# Altium schematic sheet TC387.SchDoc
size A3; SheetNumber: 3; SheetTotal: 6
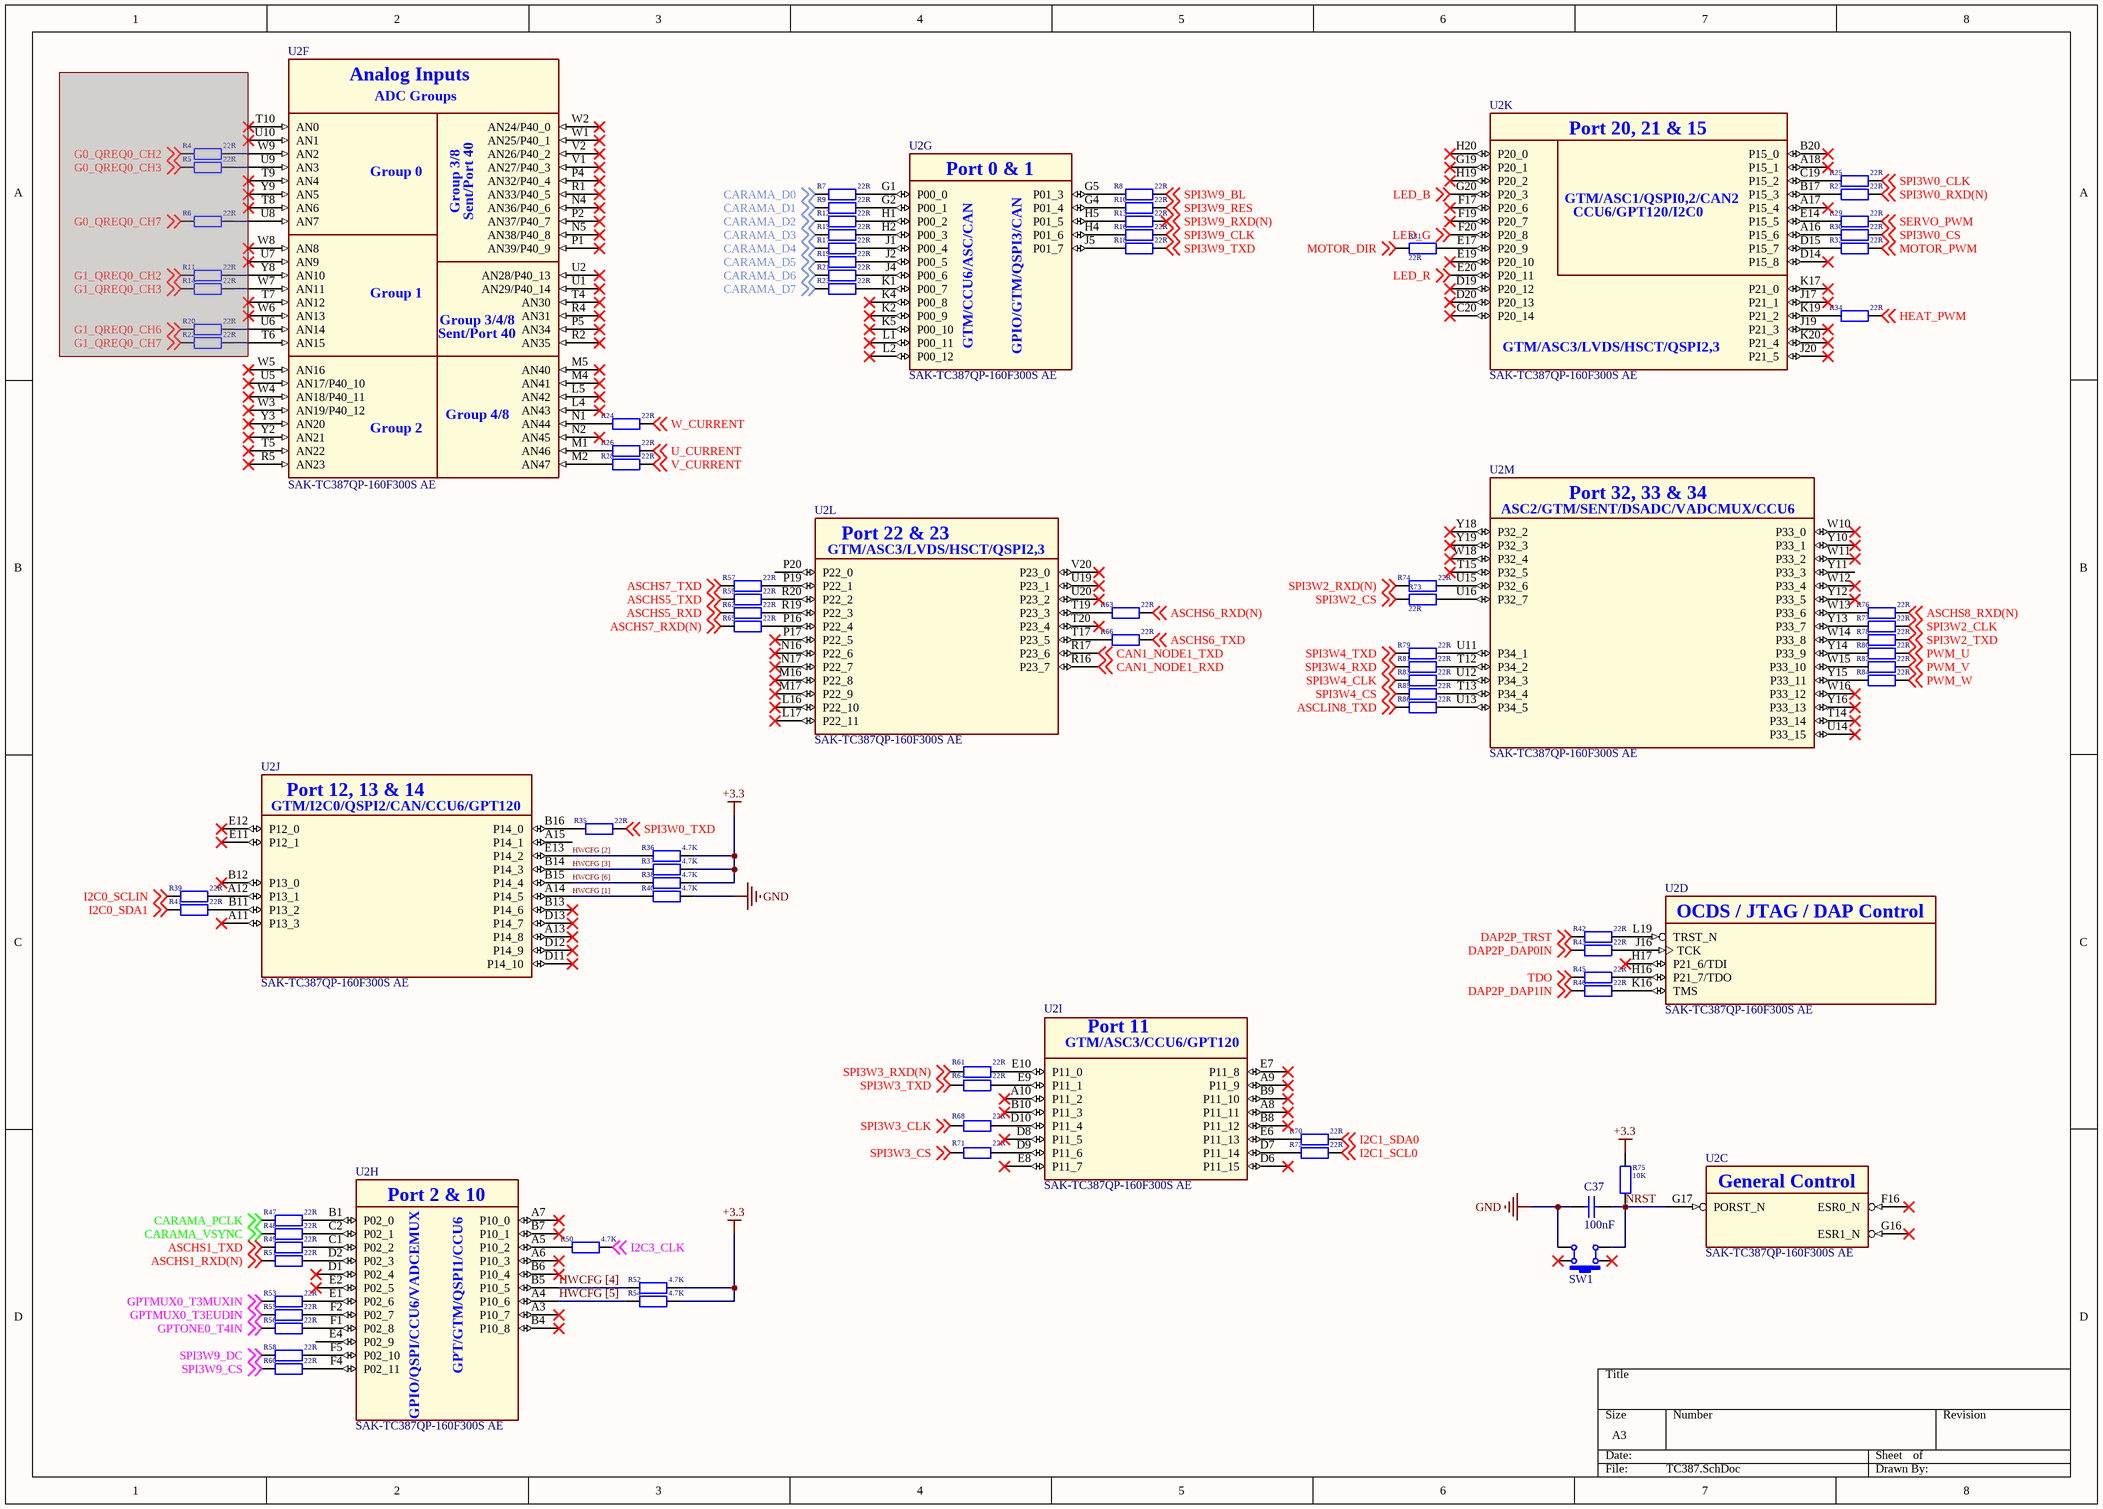
[diagram p0: TC387.SchDoc]

## Parts
C37  100nF  [C0402_L]
R4  22R  [R0402_L]  (masked out: inside a compile mask, not in the netlist)
R5  22R  [R0402_L]  (masked out: inside a compile mask, not in the netlist)
R6  22R  [R0402_L]  (masked out: inside a compile mask, not in the netlist)
R7  22R  [R0402_L]
R8  22R  [R0402_L]
R9  22R  [R0402_L]
R10  22R  [R0402_L]
R11  22R  [R0402_L]  (masked out: inside a compile mask, not in the netlist)
R12  22R  [R0402_L]
R13  22R  [R0402_L]
R14  22R  [R0402_L]  (masked out: inside a compile mask, not in the netlist)
R15  22R  [R0402_L]
R16  22R  [R0402_L]
R17  22R  [R0402_L]
R18  22R  [R0402_L]
R19  22R  [R0402_L]
R20  22R  [R0402_L]  (masked out: inside a compile mask, not in the netlist)
R21  22R  [R0402_L]
R22  22R  [R0402_L]  (masked out: inside a compile mask, not in the netlist)
R23  22R  [R0402_L]
R24  22R  [R0402_L]
R25  22R  [R0402_L]
R26  22R  [R0402_L]
R27  22R  [R0402_L]
R28  22R  [R0402_L]
R29  22R  [R0402_L]
R30  22R  [R0402_L]
R31  22R  [R0402_L]
R32  22R  [R0402_L]
R34  22R  [R0402_L]
R35  22R  [R0402_L]
R36  4.7K  [R0402_L]
R37  4.7K  [R0402_L]
R38  4.7K  [R0402_L]
R39  22R  [R0402_L]
R40  4.7K  [R0402_L]
R41  22R  [R0402_L]
R42  22R  [R0402_L]
R43  22R  [R0402_L]
R45  22R  [R0402_L]
R46  22R  [R0402_L]
R47  22R  [R0402_L]
R48  22R  [R0402_L]
R49  22R  [R0402_L]
R50  4.7K  [R0402_L]
R51  22R  [R0402_L]
R52  4.7K  [R0402_L]
R53  22R  [R0402_L]
R54  4.7K  [R0402_L]
R55  22R  [R0402_L]
R56  22R  [R0402_L]
R57  22R  [R0402_L]
R58  22R  [R0402_L]
R59  22R  [R0402_L]
R60  22R  [R0402_L]
R61  22R  [R0402_L]
R62  22R  [R0402_L]
R63  22R  [R0402_L]
R64  22R  [R0402_L]
R65  22R  [R0402_L]
R66  22R  [R0402_L]
R68  22R  [R0402_L]
R70  22R  [R0402_L]
R71  22R  [R0402_L]
R72  22R  [R0402_L]
R73  22R  [R0402_L]
R74  22R  [R0402_L]
R75  10K  [R0402_L]
R76  22R  [R0402_L]
R77  22R  [R0402_L]
R78  22R  [R0402_L]
R79  22R  [R0402_L]
R80  22R  [R0402_L]
R81  22R  [R0402_L]
R82  22R  [R0402_L]
R83  22R  [R0402_L]
R84  22R  [R0402_L]
R85  22R  [R0402_L]
R86  22R  [R0402_L]
SW1  TD-1187SA-250  [SW-SMD-3.5*3.0_4P]  (value not drawn)
U2  SAK-TC387QP-160F300S AE  [BGA292C80P20X20_1700X1700X170]  (parts C,D,F,G,H,I,J,K,L,M of 13)

## Nets
+3.3: R36.2 R37.2 R38.2 R52.2 R54.2 R75.1
GND: C37.2 R40.2 SW1.3
ASCHS1_RXD(N): R51.1 ; off-sheet ASCHS1_RXD(N)
ASCHS1_TXD: R49.1 ; off-sheet ASCHS1_TXD
ASCHS5_RXD: R62.1 ; off-sheet ASCHS5_RXD
ASCHS5_TXD: R59.1 ; off-sheet ASCHS5_TXD
ASCHS6_RXD(N): R63.2 ; off-sheet ASCHS6_RXD(N)
ASCHS6_TXD: R66.2 ; off-sheet ASCHS6_TXD
ASCHS7_RXD(N): R65.1 ; off-sheet ASCHS7_RXD(N)
ASCHS7_TXD: R57.1 ; off-sheet ASCHS7_TXD
ASCHS8_RXD(N): R76.2 ; off-sheet ASCHS8_RXD(N)
ASCLIN8_TXD: R86.1 ; off-sheet ASCLIN8_TXD
CAN1_NODE1_RXD: U2.R16(P23_7) ; off-sheet CAN1_NODE1_RXD
CAN1_NODE1_TXD: U2.R17(P23_6) ; off-sheet CAN1_NODE1_TXD
CARAMA_D0: R7.1 ; off-sheet CARAMA_D0
CARAMA_D1: R9.1 ; off-sheet CARAMA_D1
CARAMA_D2: R12.1 ; off-sheet CARAMA_D2
CARAMA_D3: R15.1 ; off-sheet CARAMA_D3
CARAMA_D4: R17.1 ; off-sheet CARAMA_D4
CARAMA_D5: R19.1 ; off-sheet CARAMA_D5
CARAMA_D6: R21.1 ; off-sheet CARAMA_D6
CARAMA_D7: R23.1 ; off-sheet CARAMA_D7
CARAMA_PCLK: R47.1 ; off-sheet CARAMA_PCLK
CARAMA_VSYNC: R48.1 ; off-sheet CARAMA_VSYNC
DAP2P_DAP0IN: R43.1 ; off-sheet DAP2P_DAP0IN
DAP2P_DAP1IN: R46.1 ; off-sheet DAP2P_DAP1IN
DAP2P_TRST: R42.1 ; off-sheet DAP2P_TRST
GPTMUX0_T3EUDIN: R55.1 ; off-sheet GPTMUX0_T3EUDIN
GPTMUX0_T3MUXIN: R53.1 ; off-sheet GPTMUX0_T3MUXIN
GPTONE0_T4IN: R56.1 ; off-sheet GPTONE0_T4IN
HEAT_PWM: R34.2 ; off-sheet HEAT_PWM
HWCFG [1]: R40.1 U2.A14(P14_5)
HWCFG [2]: R36.1 U2.E13(P14_2)
HWCFG [3]: R37.1 U2.B14(P14_3)
HWCFG [4]: R52.1 U2.B5(P10_5)
HWCFG [5]: R54.1 U2.A4(P10_6)
HWCFG [6]: R38.1 U2.B15(P14_4)
I2C0_SCLIN: R39.1 ; off-sheet I2C0_SCLIN
I2C0_SDA1: R41.1 ; off-sheet I2C0_SDA1
I2C1_SCL0: R72.2 ; off-sheet I2C1_SCL0
I2C1_SDA0: R70.2 ; off-sheet I2C1_SDA0
I2C3_CLK: R50.2 ; off-sheet I2C3_CLK
LED_B: U2.G20(P20_3) ; off-sheet LED_B
LED_G: U2.F20(P20_8) ; off-sheet LED_G
LED_R: U2.E20(P20_11) ; off-sheet LED_R
MOTOR_DIR: R31.2 ; off-sheet MOTOR_DIR
MOTOR_PWM: R32.2 ; off-sheet MOTOR_PWM
NRST: C37.1 R75.2 SW1.4 U2.G17(PORST_N)
PWM_U: R80.2 ; off-sheet PWM_U
PWM_V: R82.2 ; off-sheet PWM_V
PWM_W: R84.2 ; off-sheet PWM_W
SERVO_PWM: R29.2 ; off-sheet SERVO_PWM
SPI3W0_CLK: R25.2 ; off-sheet SPI3W0_CLK
SPI3W0_CS: R30.2 ; off-sheet SPI3W0_CS
SPI3W0_RXD(N): R27.2 ; off-sheet SPI3W0_RXD(N)
SPI3W0_TXD: R35.2 ; off-sheet SPI3W0_TXD
SPI3W2_CLK: R77.2 ; off-sheet SPI3W2_CLK
SPI3W2_CS: R73.1 ; off-sheet SPI3W2_CS
SPI3W2_RXD(N): R74.1 ; off-sheet SPI3W2_RXD(N)
SPI3W2_TXD: R78.2 ; off-sheet SPI3W2_TXD
SPI3W3_CLK: R68.2 ; off-sheet SPI3W3_CLK
SPI3W3_CS: R71.2 ; off-sheet SPI3W3_CS
SPI3W3_RXD(N): R61.2 ; off-sheet SPI3W3_RXD(N)
SPI3W3_TXD: R64.2 ; off-sheet SPI3W3_TXD
SPI3W4_CLK: R83.1 ; off-sheet SPI3W4_CLK
SPI3W4_CS: R85.1 ; off-sheet SPI3W4_CS
SPI3W4_RXD: R81.1 ; off-sheet SPI3W4_RXD
SPI3W4_TXD: R79.1 ; off-sheet SPI3W4_TXD
SPI3W9_BL: R8.2 ; off-sheet SPI3W9_BL
SPI3W9_CLK: R16.2 ; off-sheet SPI3W9_CLK
SPI3W9_CS: R60.1 ; off-sheet SPI3W9_CS
SPI3W9_DC: R58.1 ; off-sheet SPI3W9_DC
SPI3W9_RES: R10.2 ; off-sheet SPI3W9_RES
SPI3W9_RXD(N): R13.2 ; off-sheet SPI3W9_RXD(N)
SPI3W9_TXD: R18.2 ; off-sheet SPI3W9_TXD
TDO: R45.1 ; off-sheet TDO
U_CURRENT: R26.2 ; off-sheet U_CURRENT
V_CURRENT: R28.2 ; off-sheet V_CURRENT
W_CURRENT: R24.2 ; off-sheet W_CURRENT
NetR7_2: R7.2 U2.G1(P00_0)
NetR8_1: R8.1 U2.G5(P01_3)
NetR9_2: R9.2 U2.G2(P00_1)
NetR10_1: R10.1 U2.G4(P01_4)
NetR12_2: R12.2 U2.H1(P00_2)
NetR13_1: R13.1 U2.H5(P01_5)
NetR15_2: R15.2 U2.H2(P00_3)
NetR16_1: R16.1 U2.H4(P01_6)
NetR17_2: R17.2 U2.J1(P00_4)
NetR18_1: R18.1 U2.J5(P01_7)
NetR19_2: R19.2 U2.J2(P00_5)
NetR21_2: R21.2 U2.J4(P00_6)
NetR23_2: R23.2 U2.K1(P00_7)
NetR24_1: R24.1 U2.N1(AN44)
NetR25_1: R25.1 U2.C19(P15_2)
NetR26_1: R26.1 U2.M1(AN46)
NetR27_1: R27.1 U2.B17(P15_3)
NetR28_1: R28.1 U2.M2(AN47)
NetR29_1: R29.1 U2.E14(P15_5)
NetR30_1: R30.1 U2.A16(P15_6)
NetR31_1: R31.1 U2.E17(P20_9)
NetR32_1: R32.1 U2.D15(P15_7)
NetR34_1: R34.1 U2.K19(P21_2)
NetR35_1: R35.1 U2.B16(P14_0)
NetR39_2: R39.2 U2.A12(P13_1)
NetR41_2: R41.2 U2.B11(P13_2)
NetR42_2: R42.2 U2.L19(TRST_N)
NetR43_2: R43.2 U2.J16(TCK)
NetR45_2: R45.2 U2.H16(P21_7/TDO)
NetR46_2: R46.2 U2.K16(TMS)
NetR47_2: R47.2 U2.B1(P02_0)
NetR48_2: R48.2 U2.C2(P02_1)
NetR49_2: R49.2 U2.C1(P02_2)
NetR50_1: R50.1 U2.A5(P10_2)
NetR51_2: R51.2 U2.D2(P02_3)
NetR53_2: R53.2 U2.E1(P02_6)
NetR55_2: R55.2 U2.F2(P02_7)
NetR56_2: R56.2 U2.F1(P02_8)
NetR57_2: R57.2 U2.P19(P22_1)
NetR58_2: R58.2 U2.F5(P02_10)
NetR59_2: R59.2 U2.R20(P22_2)
NetR60_2: R60.2 U2.F4(P02_11)
NetR61_1: R61.1 U2.E10(P11_0)
NetR62_2: R62.2 U2.R19(P22_3)
NetR63_1: R63.1 U2.T19(P23_3)
NetR64_1: R64.1 U2.E9(P11_1)
NetR65_2: R65.2 U2.P16(P22_4)
NetR66_1: R66.1 U2.T17(P23_5)
NetR68_1: R68.1 U2.D10(P11_4)
NetR70_1: R70.1 U2.E6(P11_13)
NetR71_1: R71.1 U2.D9(P11_6)
NetR72_1: R72.1 U2.D7(P11_14)
NetR73_2: R73.2 U2.U16(P32_7)
NetR74_2: R74.2 U2.U15(P32_6)
NetR76_1: R76.1 U2.W13(P33_6)
NetR77_1: R77.1 U2.Y13(P33_7)
NetR78_1: R78.1 U2.W14(P33_8)
NetR79_2: R79.2 U2.U11(P34_1)
NetR80_1: R80.1 U2.Y14(P33_9)
NetR81_2: R81.2 U2.T12(P34_2)
NetR82_1: R82.1 U2.W15(P33_10)
NetR83_2: R83.2 U2.U12(P34_3)
NetR84_1: R84.1 U2.Y15(P33_11)
NetR85_2: R85.2 U2.T13(P34_4)
NetR86_2: R86.2 U2.U13(P34_5)

Not connected (* = marked no-connect by the designer): SW1 1* 2*; U2 A3(P10_7)* A6(P10_3)* A7(P10_0)* A8(P11_11)* A9(P11_9)* A10(P11_2)* A11(P13_3)* A13(P14_8)* A15(P14_1) A17(P15_4)* A18(P15_1)* B4(P10_8)* B6(P10_4)* B7(P10_1)* B8(P11_12)* B9(P11_10)* B10(P11_3)* B12(P13_0)* B13(P14_6)* B20(P15_0)* C20(P20_14)* D1(P02_4)* D6(P11_15)* D8(P11_5)* D11(P14_10)* D12(P14_9)* D13(P14_7)* D14(P15_8)* D19(P20_12)* D20(P20_13)* E2(P02_5)* E4(P02_9) E7(P11_8)* E8(P11_7)* E11(P12_1)* E12(P12_0)* E19(P20_10)* F16(ESR0_N)* F17(P20_6)* F19(P20_7)* G16(ESR1_N)* G19(P20_1)* H17(P21_6/TDI)* H19(P20_2)* H20(P20_0)* J17(P21_1)* J19(P21_3)* J20(P21_5)* K2(P00_9)* K4(P00_8)* K5(P00_10)* K17(P21_0)* K20(P21_4)* L1(P00_11)* L2(P00_12)* L4(AN43)* L5(AN42)* L16(P22_10)* L17(P22_11)* M4(AN41)* M5(AN40)* M16(P22_8)* M17(P22_9)* N2(AN45)* N4(AN36/P40_6)* N5(AN38/P40_8)* N16(P22_6)* N17(P22_7)* P1(AN39/P40_9)* P2(AN37/P40_7)* P4(AN32/P40_4)* P5(AN34)* P17(P22_5)* P20(P22_0) R1(AN33/P40_5)* R2(AN35)* R4(AN31)* R5(AN23)* T4(AN30)* T5(AN22)* T6(AN15) T7(AN12)* T8(AN6)* T9(AN4)* T10(AN0)* T14(P33_14)* T15(P32_5)* T20(P23_4)* U1(AN29/P40_14)* U2(AN28/P40_13)* U5(AN17/P40_10)* U6(AN14) U7(AN9)* U8(AN7) U9(AN3) U10(AN1)* U14(P33_15)* U19(P23_1)* U20(P23_2)* V1(AN27/P40_3)* V2(AN26/P40_2)* V20(P23_0)* W1(AN25/P40_1)* W2(AN24/P40_0)* W3(AN19/P40_12)* W4(AN18/P40_11)* W5(AN16)* W6(AN13)* W7(AN11) W8(AN8)* W9(AN2) W10(P33_0)* W11(P33_2)* W12(P33_4)* W16(P33_12)* W18(P32_4)* Y2(AN21)* Y3(AN20)* Y8(AN10) Y9(AN5)* Y10(P33_1)* Y11(P33_3) Y12(P33_5)* Y16(P33_13)* Y18(P32_2)* Y19(P32_3)*

## Notes on the sheet
- (in symbol SAK-TC387QP-160F300S AE, part C) General Control
- (in symbol SAK-TC387QP-160F300S AE, part D) OCDS / JTAG / DAP Control
- (in symbol SAK-TC387QP-160F300S AE, part F) Analog Inputs; ADC Groups; Group 0; Group 3/8; Sent/Port 40; Group 1; Group 3/4/8; Group 4/8; Group 2
- (in symbol SAK-TC387QP-160F300S AE, part G) Port 0 & 1; GTM/CCU6/ASC/CAN; GPIO/GTM/QSPI3/CAN
- (in symbol SAK-TC387QP-160F300S AE, part H) Port 2 & 10; GPT/GTM/QSPI1/CCU6; GPIO/QSPI/CCU6/VADCEMUX
- (in symbol SAK-TC387QP-160F300S AE, part I) Port 11; GTM/ASC3/CCU6/GPT120
- (in symbol SAK-TC387QP-160F300S AE, part J) Port 12, 13 & 14; GTM/I2C0/QSPI2/CAN/CCU6/GPT120
- (in symbol SAK-TC387QP-160F300S AE, part K) Port 20, 21 & 15; GTM/ASC1/QSPI0,2/CAN2; CCU6/GPT120/I2C0; GTM/ASC3/LVDS/HSCT/QSPI2,3
- (in symbol SAK-TC387QP-160F300S AE, part L) Port 22 & 23; GTM/ASC3/LVDS/HSCT/QSPI2,3
- (in symbol SAK-TC387QP-160F300S AE, part M) Port 32, 33 & 34; ASC2/GTM/SENT/DSADC/VADCMUX/CCU6

## Library data of the parts
C37 = CMP-002-000000-1: 贴片电容/MLCC电容; BOM名称: 无极性贴片电容; 当前库版本V2023.5.31 @淘宝卖家:黄晶宝石: 最新版本发布https://item.taobao.com/item.htm?id=566775463719; Design Item ID: C; Source: 0.1 - 电阻-电容-电感-保险丝-晶振-晶体-磁珠-电位器-法拉电容-馈通电容.SchLib
R4-R32 R34-R43 R45-R66 R68 R70-R86 = R: 贴片电阻; 联系下单店铺卖家 免费帮你查找封装: 联系下单店铺卖家 免费技术支持; BOM名称: 贴片电阻
SW1 = TD-1187SA-250: 小乌龟-侧按4脚开关 带定位柱; 联系下单店铺卖家 免费技术支持: 联系下单店铺卖家 免费帮你查找封装
U2 = SAK-TC387QP-160F300S AE: 32-Bit Single-Chip Microcontroller; Manufacturer: Infineon Technologies; Manufacturer Order Number: SAK-TC387QP-160F300S AE; PackageReference: PG-LFBGA-292